# Altium schematic sheet Temperature.SchDoc
size A4
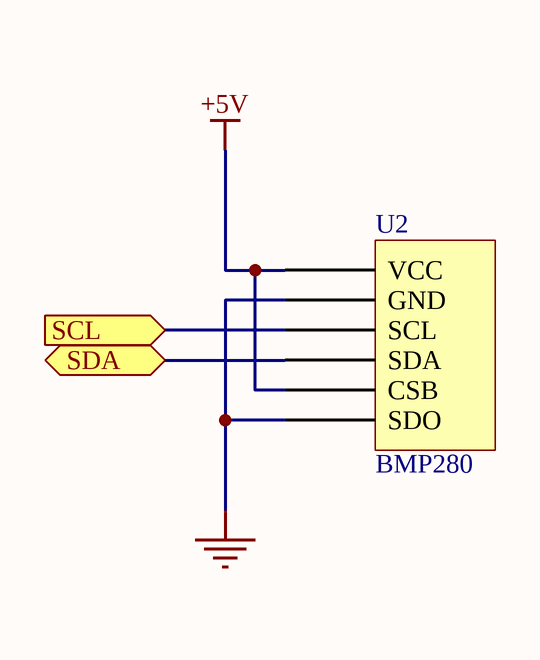
[diagram p0: Temperature.SchDoc]

## Parts
U2  BMP280

## Ports
SCL (in), SDA (bidir)

## Nets
+5V: U2.CSB U2.VCC
GND: U2.GND U2.SDO
SCL: U2.SCL ; port SCL
SDA: U2.SDA ; port SDA

## Notes on the sheet
- Title
- Size:
- Date:
- A4
- Number:
- Time:
- Revision:
- Sheet
- of
- File:

## Library data of the parts
U2 = BMP280: Temperature